# Altium schematic sheet Power_and_Connectors.SchDoc: Power_and_Connectors
size A4; DocumentNumber: 2; SheetNumber: 2; SheetTotal: 2
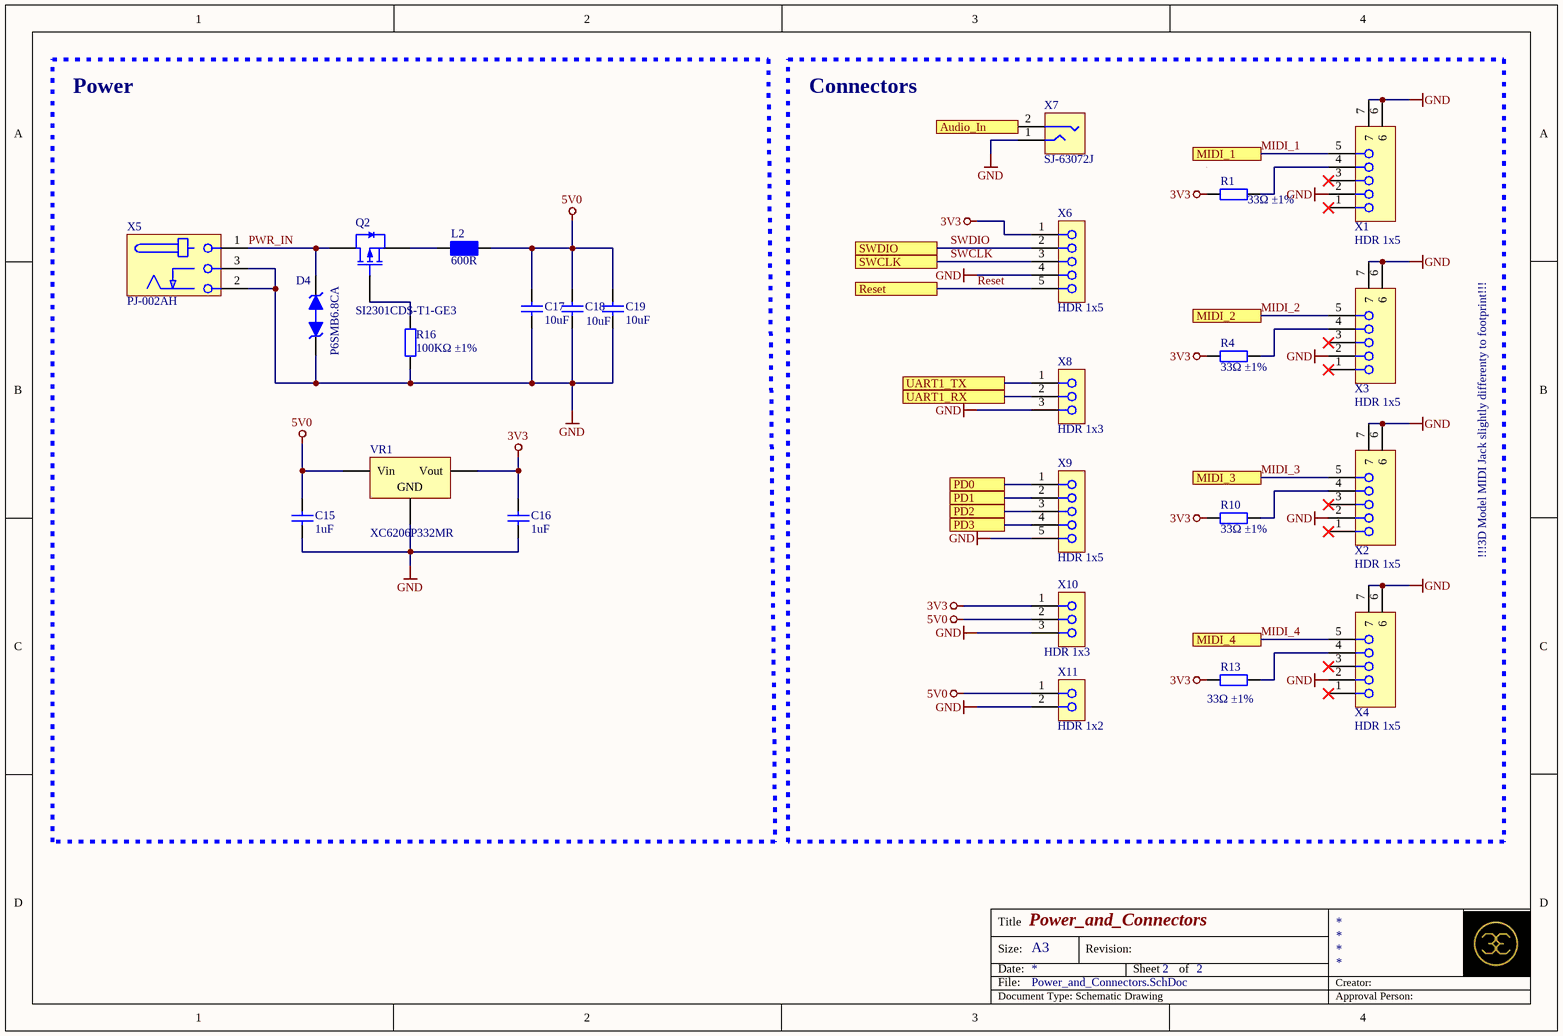
[diagram p0: Power_and_Connectors.SchDoc]

## Parts
C15  1uF  [0603_C]
C16  1uF  [0603_C]
C17  10uF  [0805_C]
C18  10uF  [0805_C]
C19  10uF  [0805_C]
D4  P6SMB6.8CA  [SMB(DO-214AA)_S1]
L2  600R  [INDC2012X85N]
Q2  SI2301CDS-T1-GE3  [SOT-23(SOT-23-3)]
R1  33Ω ±1%  [0603_R]
R4  33Ω ±1%  [0603_R]
R10  33Ω ±1%  [0603_R]
R13  33Ω ±1%  [0603_R]
R16  100KΩ ±1%  [0603_R]
VR1  XC6206P332MR  [SOT-23-3L]
X1  HDR 1x5  [MABP 5S]
X2  HDR 1x5  [MABP 5S]
X3  HDR 1x5  [MABP 5S]
X4  HDR 1x5  [MABP 5S]
X5  PJ-002AH  [PJ3L1400H110]
X6  HDR 1x5  [CON_HEADER2.54_1x5W]
X7  SJ-63072J  [CUI_SJ-63072J]
X8  HDR 1x3  [CON_HEADER2.54_1x3W]
X9  HDR 1x5  [CON_HEADER2.54_1x5W]
X10  HDR 1x3  [CON_HEADER2.54_1x3W]
X11  HDR 1x2  [CON_HEADER2.54_1x2W]

## Blocks framed on the sheet
Power: C15-C19 D4 L2 Q2 R16 VR1 X5
Connectors: R1 R4 R10 R13 X1-X4 X6-X11

## Ports
Audio_In, MIDI_1, MIDI_2, MIDI_3, MIDI_4, PD0, PD1, PD2, PD3, Reset, SWCLK, SWDIO, UART1_RX, UART1_TX

## Nets
3V3: C16.2 R1.1 R4.1 R10.1 R13.1 VR1.2(Vout) X6.1 X10.1
5V0: C15.2 C17.2 C18.2 C19.2 L2.2 VR1.3(Vin) X10.2 X11.1
GND: C15.1 C16.1 C17.1 C18.1 C19.1 D4.A1 R16.1 VR1.1(GND) X1.2 X1.6 X1.7 X2.2 X2.6 X2.7 X3.2 X3.6 X3.7 X4.2 X4.6 X4.7 X5.2 X5.3 X6.4 X7.1 X8.3 X9.5 X10.3 X11.2
Audio_In: X7.2 ; port Audio_In
MIDI_1: X1.5 ; port MIDI_1
MIDI_2: X3.5 ; port MIDI_2
MIDI_3: X2.5 ; port MIDI_3
MIDI_4: X4.5 ; port MIDI_4
PD0: X9.1 ; port PD0
PD1: X9.2 ; port PD1
PD2: X9.3 ; port PD2
PD3: X9.4 ; port PD3
PWR_IN: D4.A2 Q2.3(D) X5.1
Reset: X6.5 ; port Reset
SWCLK: X6.3 ; port SWCLK
SWDIO: X6.2 ; port SWDIO
UART1_RX: X8.2 ; port UART1_RX
UART1_TX: X8.1 ; port UART1_TX
NetL2_1: L2.1 Q2.2(S)
NetQ2_1: Q2.1(G) R16.2
NetR1_2: R1.2 X1.4
NetR4_2: R4.2 X3.4
NetR10_2: R10.2 X2.4
NetR13_2: R13.2 X4.4

Not connected (* = marked no-connect by the designer): X1 1* 3*; X2 1* 3*; X3 1* 3*; X4 1* 3*

## Notes on the sheet
- !!!3D Model MIDI Jack slightly differenty to footprint!!!
- Title
- Size:
- Date:
- File:
- A3
- Revision:
- Sheet
- of
- Creator:
- Document Type: Schematic Drawing
- Approval Person:

## Library data of the parts
C15 C16 = 0603 1uF (105) 10% 50V: Chip capacitors; Manufacturer: Samsung Electro-Mechanics; PartNumber: CL10A105KB8NNNC; Tolerance: 10%; Voltage: 50V; ComponentLink1Description: Supplier link; ComponentLink1URL: http://www.szlcsc.com/product/details_16531.html; Package: 0603; Supplier: LC; SuppliersPartNumber: C15849; Capacitance: 1uF
C17-C19 = 0805 10uF (106) 10% 25V: Chip capacitors; Manufacturer: Samsung Electro-Mechanics; PartNumber: CL21A106KAYNNNE; Tolerance: 10%; Voltage: 25V; ComponentLink1Description: Supplier link; ComponentLink1URL: http://www.szlcsc.com/product/details_16532.html; Package: 0805; Supplier: LC; SuppliersPartNumber: C15850; Capacitance: 10uF
D4 = DIO_P6SMB6.8CA: TVS 6.8V; Manufacturer: Brightking Elec; Alternatives allowed: YES; Manufacturer Part Number: P6SMB6.8CA; Voltage Rating: 6.8V; JLC: C78395
L2 = FB_600R_600mA_0805: Ferrite Beads 0805 600 OHM; Manufacturer: Murata Electronics; Manufacturer Part Number: BLM21AG601SN1D; Lumira Part Number: MS-1042; Tolerance: 25%; Alternatives allowed: YES; JLC: C1017
Q2 = SI2301CDS-T1-GE3: MOS(场效应管); ComponentLink1Description: 供应商链接; ComponentLink1URL: http://www.szlcsc.com/product/details_11030.html; Package: SOT-23(SOT-23-3); Supplier: LC; SuppliersPartNumber: C10487
R1 R4 R10 R13 = 0603 33R (33R0) 1%: Chip resistor; Manufacturer: Uniroyal Elec; PartNumber: 0603WAF330JT5E; Power: 1/10W; ComponentLink1Description: Supplier link; ComponentLink1URL: http://www.szlcsc.com/product/details_23867.html; Package: 0603; Supplier: LC; SuppliersPartNumber: C23140; Resistance: 33Ω; Tolerance: 1%
R16 = 0603 100K (1003) 1%: Chip resistor; Manufacturer: Uniroyal Elec; PartNumber: 0603WAF1003T5E; Power: 1/10W; ComponentLink1Description: Supplier link; ComponentLink1URL: http://www.szlcsc.com/product/details_26546.html; Package: 0603; Supplier: LC; SuppliersPartNumber: C25803; Resistance: 100KΩ; Tolerance: 1%
VR1 = SOT-23 XC6206P332MR: 低压差线性稳压(LDO); ComponentLink1Description: 供应商链接; ComponentLink1URL: http://www.szlcsc.com/product/details_5896.html; Package: SOT-23; Supplier: LC; SuppliersPartNumber: C5446
X1-X4 = CON_HEADER_1X5: Board-to-Board-Steckverbinder, 2.54 mm, 5 Kontakt(e), Stiftleiste 1-Reihig; Manufacturer: BKL; Alternatives allowed: NO; Manufacturer Part Number: MABP 5S
X5 = PJ-002AH: DC Power Connectors Power Jacks, Inside Contact Diameter 2mm, Outside Contact Diameter 6,5mm; Manufacturer: CUI Devices; Lumira Part Number: S-QMS-SPEC-32532; Voltage Rating: 24V; Alternatives allowed: NO; Manufacturer Part Number: PJ-002AH
X6 X9 = CON_HEADER_1X5: Board-to-Board-Steckverbinder, 2.54 mm, 5 Kontakt(e), Stiftleiste 1-Reihig; Manufacturer: Samtec; Manufacturer Part Number: TSW-105-07-T-S; Alternatives allowed: YES
X7 = Phone_Jack_1/4: Telefon-Steckverbinder 1/4"JACK HOR CHASIS CON PLSTC MNT; Manufacturer: CUI Devices; Alternatives allowed: NO; Manufacturer Part Number: SJ-63072J
X8 X10 = CON_HEADER_1X3: Board-to-Board-Steckverbinder, 2.54 mm, 3 Kontakt(e), Stiftleiste 1-Reihig; Manufacturer: Samtec; Manufacturer Part Number: TSW-103-07-T-S; Lumira Part Number: S-QMS-SPEC-32502; Alternatives allowed: YES
X11 = CON_HEADER_1X2: Board-to-Board-Steckverbinder, 2.54 mm, 2 Kontakt(e), Stiftleiste 1-Reihig; Manufacturer: Samtec; Manufacturer Part Number: TSW-102-07-T-S; Lumira Part Number: S-QMS-SPEC-32507; Alternatives allowed: YES